# Altium schematic sheet power.SchDoc
size A4
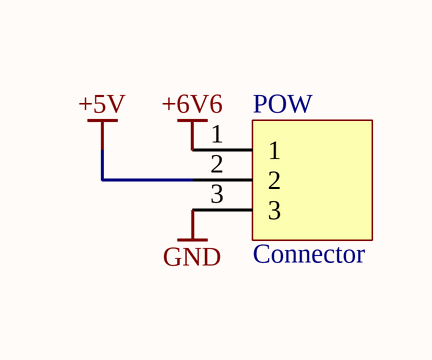
[diagram p0: power.SchDoc]

## Parts
POW  Connector  [FP_CONN3_TAP_254MM]

## Nets
+5V: POW.2
+6V6: POW.1
GND: POW.3

## Library data of the parts
POW = Connector_3pin: 3pin connector